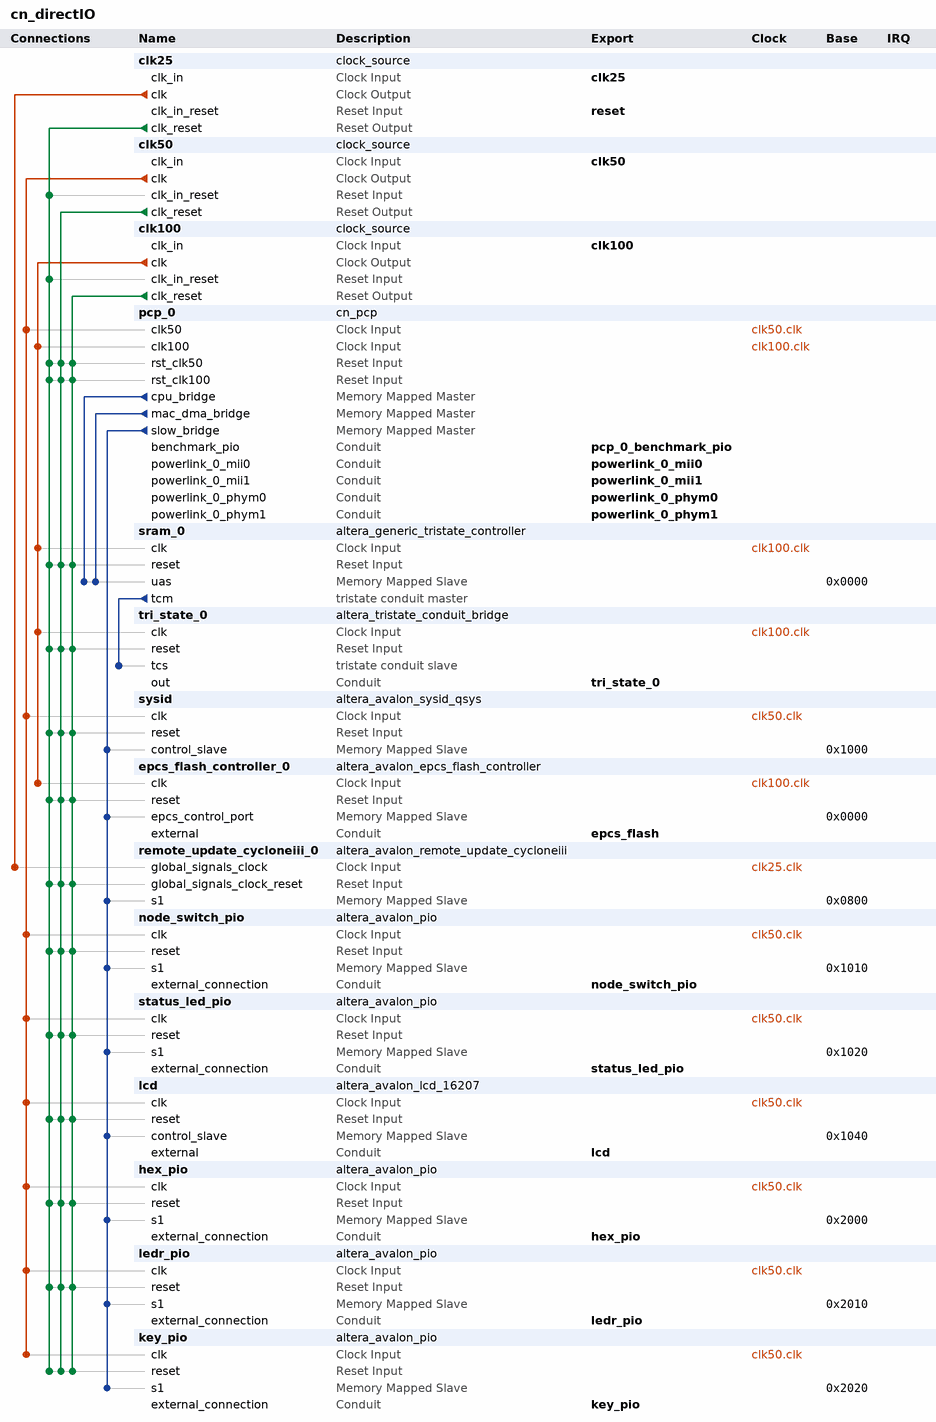
[diagram p0: system contents]
# Platform Designer (Qsys) system cn_directIO, Cyclone IV E EP4CE115F29C7
# Parameters at their usual value, and those the tool derives, are not listed.
package require -exact qsys 13.0
create_system cn_directIO
set_project_property DEVICE_FAMILY {Cyclone IV E}
set_project_property DEVICE EP4CE115F29C7

add_instance clk25 clock_source 13.0
set_instance_parameter_value clk25 clockFrequency 25000000

add_instance clk50 clock_source 13.0
set_instance_parameter_value clk50 clockFrequency 50000000

add_instance clk100 clock_source 13.0
set_instance_parameter_value clk100 clockFrequency 100000000

add_instance pcp_0 cn_pcp 1.0

add_instance sram_0 altera_generic_tristate_controller 13.0
set_instance_parameter_value sram_0 TCM_ADDRESS_W 21
set_instance_parameter_value sram_0 TCM_DATA_W 16
set_instance_parameter_value sram_0 TCM_BYTEENABLE_W 2
set_instance_parameter_value sram_0 TCM_READ_WAIT 1
set_instance_parameter_value sram_0 TCM_WRITE_WAIT 0
set_instance_parameter_value sram_0 TCM_SETUP_WAIT 0
set_instance_parameter_value sram_0 TCM_DATA_HOLD 0
set_instance_parameter_value sram_0 TCM_MAX_PENDING_READ_TRANSACTIONS 1
set_instance_parameter_value sram_0 TCM_TURNAROUND_TIME 1
set_instance_parameter_value sram_0 TCM_TIMING_UNITS 1
set_instance_parameter_value sram_0 TCM_READLATENCY 2
set_instance_parameter_value sram_0 TCM_SYMBOLS_PER_WORD 2
set_instance_parameter_value sram_0 USE_READ 1
set_instance_parameter_value sram_0 USE_BEGINTRANSFER 0
set_instance_parameter_value sram_0 USE_BYTEENABLE 1
set_instance_parameter_value sram_0 USE_OUTPUTENABLE 0
set_instance_parameter_value sram_0 ACTIVE_LOW_READ 1
set_instance_parameter_value sram_0 ACTIVE_LOW_BYTEENABLE 1
set_instance_parameter_value sram_0 ACTIVE_LOW_OUTPUTENABLE 0
set_instance_parameter_value sram_0 ACTIVE_LOW_BEGINTRANSFER 0
set_instance_parameter_value sram_0 CHIPSELECT_THROUGH_READLATENCY 0
set_instance_parameter_value sram_0 MODULE_ASSIGNMENT_KEYS embeddedsw.CMacro.SIZE
set_instance_parameter_value sram_0 MODULE_ASSIGNMENT_VALUES 2097152

add_instance tri_state_0 altera_tristate_conduit_bridge 13.0

add_instance sysid altera_avalon_sysid_qsys 13.0
set_instance_parameter_value sysid id 0

add_instance epcs_flash_controller_0 altera_avalon_epcs_flash_controller 13.0.1.99.2

add_instance remote_update_cycloneiii_0 altera_avalon_remote_update_cycloneiii 13.0
set_instance_parameter_value remote_update_cycloneiii_0 clockFrequency 25000000

add_instance node_switch_pio altera_avalon_pio 13.0.1.99.2
set_instance_parameter_value node_switch_pio direction Input
set_instance_parameter_value node_switch_pio width 8

add_instance status_led_pio altera_avalon_pio 13.0.1.99.2
set_instance_parameter_value status_led_pio bitModifyingOutReg true
set_instance_parameter_value status_led_pio direction Output
set_instance_parameter_value status_led_pio width 2

add_instance lcd altera_avalon_lcd_16207 13.0.1.99.2

add_instance hex_pio altera_avalon_pio 13.0.1.99.2
set_instance_parameter_value hex_pio direction Output
set_instance_parameter_value hex_pio width 32

add_instance ledr_pio altera_avalon_pio 13.0.1.99.2
set_instance_parameter_value ledr_pio direction Output
set_instance_parameter_value ledr_pio width 16

add_instance key_pio altera_avalon_pio 13.0.1.99.2
set_instance_parameter_value key_pio direction Input
set_instance_parameter_value key_pio width 4

# connections
add_connection clk25.clk remote_update_cycloneiii_0.global_signals_clock clock
add_connection clk50.clk hex_pio.clk clock
add_connection clk50.clk key_pio.clk clock
add_connection clk50.clk lcd.clk clock
add_connection clk50.clk ledr_pio.clk clock
add_connection clk50.clk node_switch_pio.clk clock
add_connection clk50.clk pcp_0.clk50 clock
add_connection clk50.clk status_led_pio.clk clock
add_connection clk50.clk sysid.clk clock
add_connection clk100.clk epcs_flash_controller_0.clk clock
add_connection clk100.clk pcp_0.clk100 clock
add_connection clk100.clk sram_0.clk clock
add_connection clk100.clk tri_state_0.clk clock
add_connection clk25.clk_reset clk50.clk_in_reset reset
add_connection clk25.clk_reset clk100.clk_in_reset reset
add_connection clk25.clk_reset epcs_flash_controller_0.reset reset
add_connection clk25.clk_reset hex_pio.reset reset
add_connection clk25.clk_reset key_pio.reset reset
add_connection clk25.clk_reset lcd.reset reset
add_connection clk25.clk_reset ledr_pio.reset reset
add_connection clk25.clk_reset node_switch_pio.reset reset
add_connection clk25.clk_reset pcp_0.rst_clk50 reset
add_connection clk25.clk_reset pcp_0.rst_clk100 reset
add_connection clk25.clk_reset remote_update_cycloneiii_0.global_signals_clock_reset reset
add_connection clk25.clk_reset sram_0.reset reset
add_connection clk25.clk_reset status_led_pio.reset reset
add_connection clk25.clk_reset sysid.reset reset
add_connection clk25.clk_reset tri_state_0.reset reset
add_connection clk50.clk_reset epcs_flash_controller_0.reset reset
add_connection clk50.clk_reset hex_pio.reset reset
add_connection clk50.clk_reset key_pio.reset reset
add_connection clk50.clk_reset lcd.reset reset
add_connection clk50.clk_reset ledr_pio.reset reset
add_connection clk50.clk_reset node_switch_pio.reset reset
add_connection clk50.clk_reset pcp_0.rst_clk50 reset
add_connection clk50.clk_reset pcp_0.rst_clk100 reset
add_connection clk50.clk_reset remote_update_cycloneiii_0.global_signals_clock_reset reset
add_connection clk50.clk_reset sram_0.reset reset
add_connection clk50.clk_reset status_led_pio.reset reset
add_connection clk50.clk_reset sysid.reset reset
add_connection clk50.clk_reset tri_state_0.reset reset
add_connection clk100.clk_reset epcs_flash_controller_0.reset reset
add_connection clk100.clk_reset hex_pio.reset reset
add_connection clk100.clk_reset key_pio.reset reset
add_connection clk100.clk_reset lcd.reset reset
add_connection clk100.clk_reset ledr_pio.reset reset
add_connection clk100.clk_reset node_switch_pio.reset reset
add_connection clk100.clk_reset pcp_0.rst_clk50 reset
add_connection clk100.clk_reset pcp_0.rst_clk100 reset
add_connection clk100.clk_reset remote_update_cycloneiii_0.global_signals_clock_reset reset
add_connection clk100.clk_reset sram_0.reset reset
add_connection clk100.clk_reset status_led_pio.reset reset
add_connection clk100.clk_reset sysid.reset reset
add_connection clk100.clk_reset tri_state_0.reset reset
add_connection pcp_0.cpu_bridge sram_0.uas avalon
set_connection_parameter_value pcp_0.cpu_bridge/sram_0.uas baseAddress 0x0000
add_connection pcp_0.mac_dma_bridge sram_0.uas avalon
set_connection_parameter_value pcp_0.mac_dma_bridge/sram_0.uas baseAddress 0x0000
add_connection pcp_0.slow_bridge epcs_flash_controller_0.epcs_control_port avalon
set_connection_parameter_value pcp_0.slow_bridge/epcs_flash_controller_0.epcs_control_port baseAddress 0x0000
add_connection pcp_0.slow_bridge hex_pio.s1 avalon
set_connection_parameter_value pcp_0.slow_bridge/hex_pio.s1 baseAddress 0x2000
add_connection pcp_0.slow_bridge key_pio.s1 avalon
set_connection_parameter_value pcp_0.slow_bridge/key_pio.s1 baseAddress 0x2020
add_connection pcp_0.slow_bridge lcd.control_slave avalon
set_connection_parameter_value pcp_0.slow_bridge/lcd.control_slave baseAddress 0x1040
add_connection pcp_0.slow_bridge ledr_pio.s1 avalon
set_connection_parameter_value pcp_0.slow_bridge/ledr_pio.s1 baseAddress 0x2010
add_connection pcp_0.slow_bridge node_switch_pio.s1 avalon
set_connection_parameter_value pcp_0.slow_bridge/node_switch_pio.s1 baseAddress 0x1010
add_connection pcp_0.slow_bridge remote_update_cycloneiii_0.s1 avalon
set_connection_parameter_value pcp_0.slow_bridge/remote_update_cycloneiii_0.s1 baseAddress 0x0800
add_connection pcp_0.slow_bridge status_led_pio.s1 avalon
set_connection_parameter_value pcp_0.slow_bridge/status_led_pio.s1 baseAddress 0x1020
add_connection pcp_0.slow_bridge sysid.control_slave avalon
set_connection_parameter_value pcp_0.slow_bridge/sysid.control_slave baseAddress 0x1000
add_connection sram_0.tcm tri_state_0.tcs tristate_conduit

# exported interfaces
add_interface clk50 clock sink
set_interface_property clk50 EXPORT_OF clk50.clk_in
add_interface clk100 clock sink
set_interface_property clk100 EXPORT_OF clk100.clk_in
add_interface lcd conduit end
set_interface_property lcd EXPORT_OF lcd.external
add_interface node_switch_pio conduit end
set_interface_property node_switch_pio EXPORT_OF node_switch_pio.external_connection
add_interface status_led_pio conduit end
set_interface_property status_led_pio EXPORT_OF status_led_pio.external_connection
add_interface clk25 clock sink
set_interface_property clk25 EXPORT_OF clk25.clk_in
add_interface epcs_flash conduit end
set_interface_property epcs_flash EXPORT_OF epcs_flash_controller_0.external
add_interface powerlink_0_mii1 conduit end
set_interface_property powerlink_0_mii1 EXPORT_OF pcp_0.powerlink_0_mii1
add_interface powerlink_0_mii0 conduit end
set_interface_property powerlink_0_mii0 EXPORT_OF pcp_0.powerlink_0_mii0
add_interface powerlink_0_phym1 conduit end
set_interface_property powerlink_0_phym1 EXPORT_OF pcp_0.powerlink_0_phym1
add_interface powerlink_0_phym0 conduit end
set_interface_property powerlink_0_phym0 EXPORT_OF pcp_0.powerlink_0_phym0
add_interface pcp_0_benchmark_pio conduit end
set_interface_property pcp_0_benchmark_pio EXPORT_OF pcp_0.benchmark_pio
add_interface reset reset sink
set_interface_property reset EXPORT_OF clk25.clk_in_reset
add_interface tri_state_0 conduit end
set_interface_property tri_state_0 EXPORT_OF tri_state_0.out
add_interface hex_pio conduit end
set_interface_property hex_pio EXPORT_OF hex_pio.external_connection
add_interface ledr_pio conduit end
set_interface_property ledr_pio EXPORT_OF ledr_pio.external_connection
add_interface key_pio conduit end
set_interface_property key_pio EXPORT_OF key_pio.external_connection

set_interconnect_requirement {$system} qsys_mm.clockCrossingAdapter HANDSHAKE
set_interconnect_requirement {$system} qsys_mm.maxAdditionalLatency 1

save_system cn_directIO.qsys
